# EAGLE board regsimple2addfp (EAGLE 7.5.0), part 1 of 2
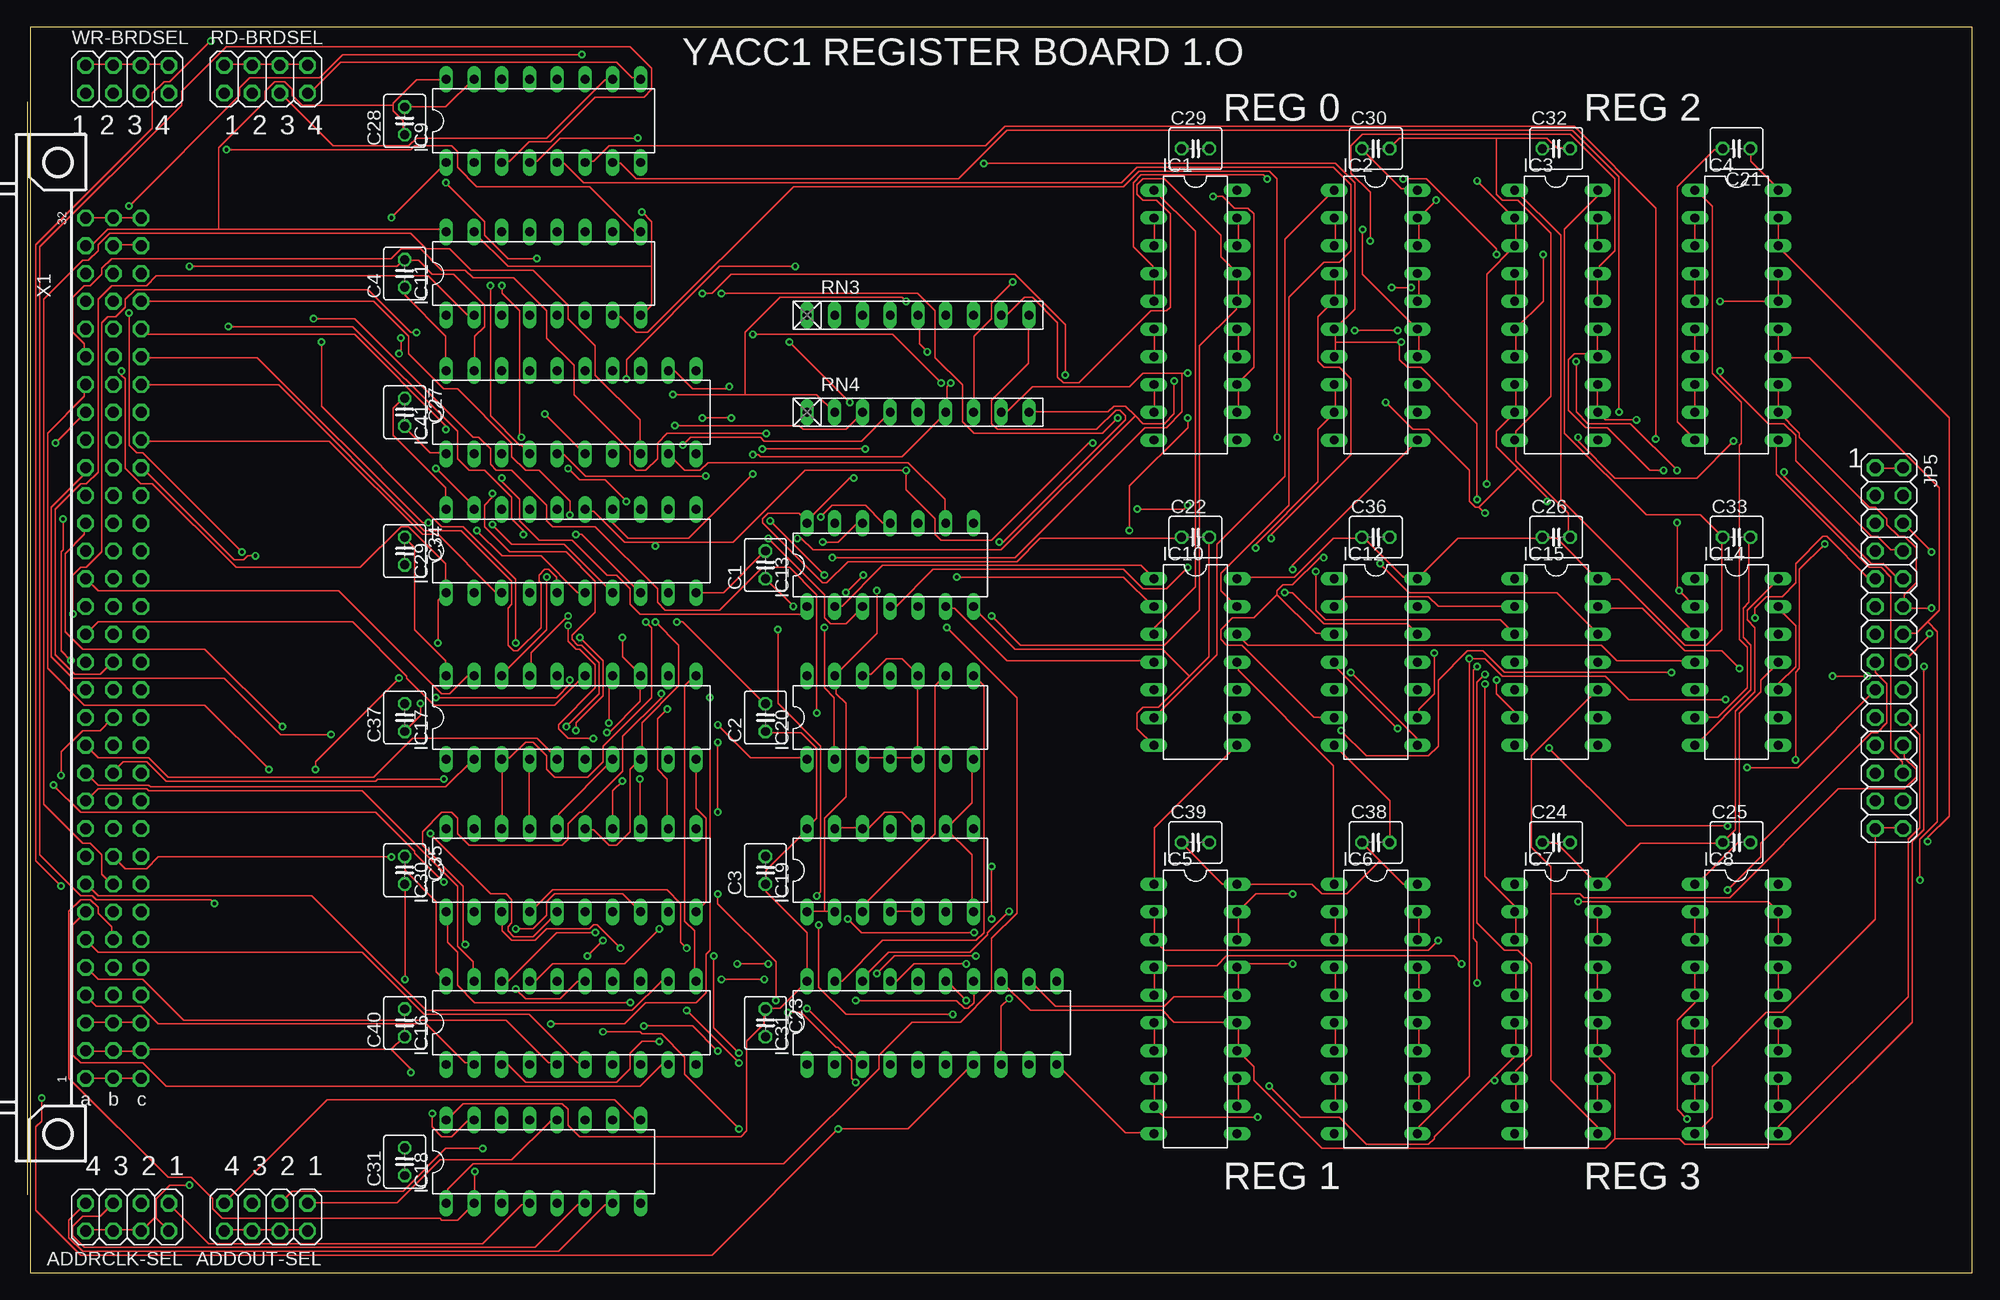
[diagram p2: board, top side]
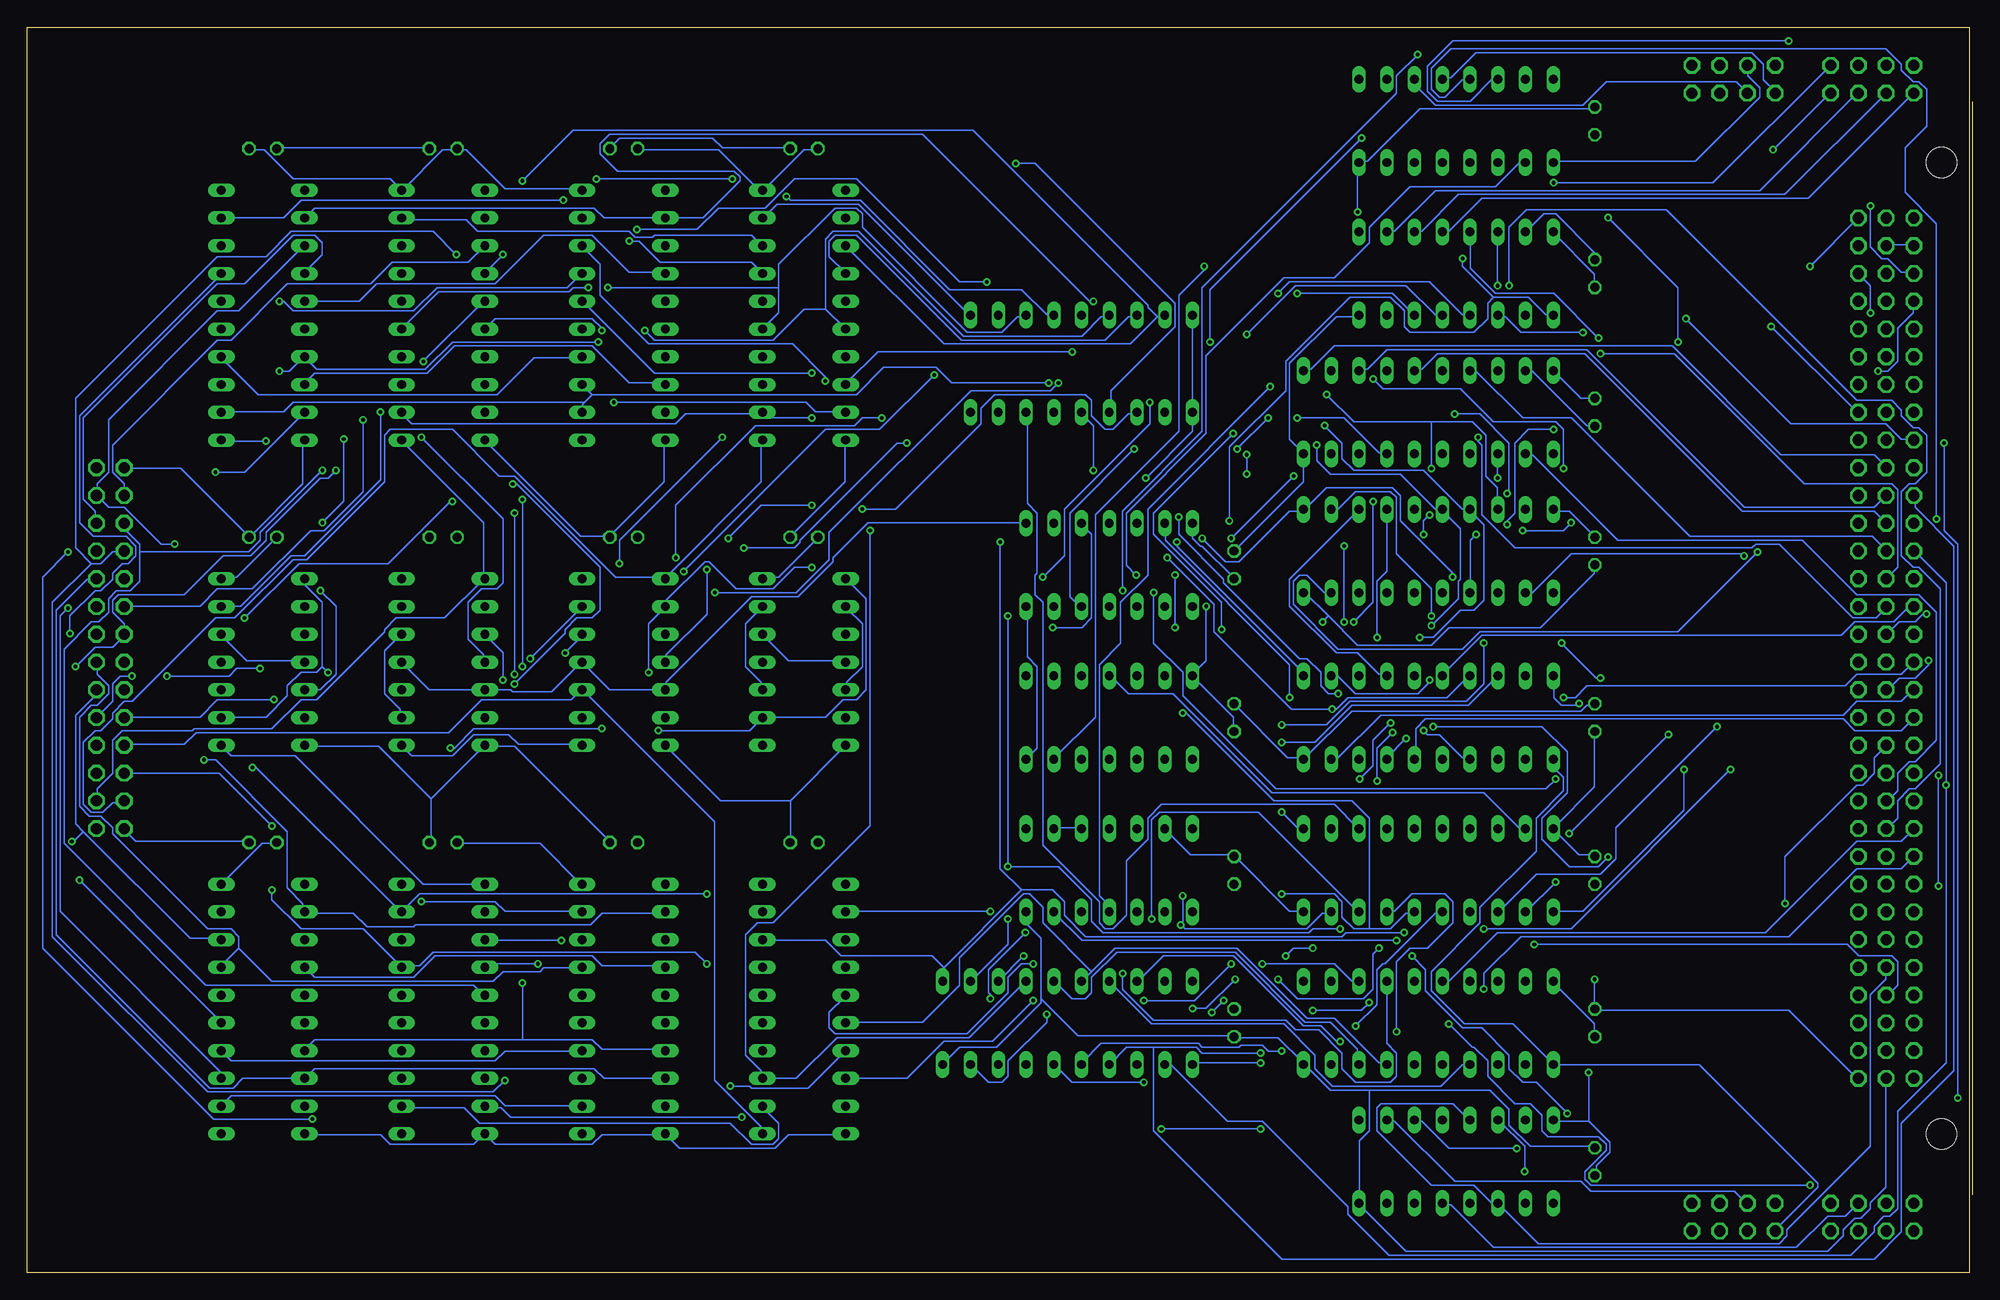
[diagram p3: board, bottom side, seen from below]

Size 177.78 x 113.97 mm. Coordinates in mm from the lower left corner, seen from the top.
Outline: 0,0 177.78,0 177.78,113.97 0,113.97 0,0
Copper layers (1*16): Top 0.0356mm / dielectric 1.5011mm / Bottom 0.0356mm
Design rules "LaenPCBOrder *": minimum track width 6mil, minimum drill 13mil, track to track 8mil, track to pad 8mil, pad to pad 8mil, via to via 8mil, smd to smd 6mil, copper to edge 15mil, drill to drill 6mil, minimum pad ring 7mil, minimum via ring 7mil, stop-mask expansion 3mil, vias tented up to drill 0mil, thermal gap 10mil

## Footprints (pad centres in the part's own frame; a part is rotated, then mirrored left to right if it is on the bottom)
2X04 = drill 1.016 octagon: 1 -3.81,-1.27; 2 -3.81,1.27; 3 -1.27,-1.27; 4 -1.27,1.27; 5 1.27,-1.27; 6 1.27,1.27; 7 3.81,-1.27; 8 3.81,1.27
C025-040X050 = drill 0.813 octagon: 1 -1.27,0; 2 1.27,0
DIL20 = drill 0.813 long: 1 -11.43,-3.81; 2 -8.89,-3.81; 3 -6.35,-3.81; 4 -3.81,-3.81; 5 -1.27,-3.81; 6 1.27,-3.81; 7 3.81,-3.81; 8 6.35,-3.81; 9 8.89,-3.81; 10 11.43,-3.81; 11 11.43,3.81; 12 8.89,3.81; 13 6.35,3.81; 14 3.81,3.81; 15 1.27,3.81; 16 -1.27,3.81; 17 -3.81,3.81; 18 -6.35,3.81; 19 -8.89,3.81; 20 -11.43,3.81
DIL16 = drill 0.813 long: 1 -8.89,-3.81; 2 -6.35,-3.81; 3 -3.81,-3.81; 4 -1.27,-3.81; 5 1.27,-3.81; 6 3.81,-3.81; 7 6.35,-3.81; 8 8.89,-3.81; 9 8.89,3.81; 10 6.35,3.81; 11 3.81,3.81; 12 1.27,3.81; 13 -1.27,3.81; 14 -3.81,3.81; 15 -6.35,3.81; 16 -8.89,3.81
DIL14 = drill 0.813 long: 1 -7.62,-3.81; 2 -5.08,-3.81; 3 -2.54,-3.81; 4 0,-3.81; 5 2.54,-3.81; 6 5.08,-3.81; 7 7.62,-3.81; 8 7.62,3.81; 9 5.08,3.81; 10 2.54,3.81; 11 0,3.81; 12 -2.54,3.81; 13 -5.08,3.81; 14 -7.62,3.81
2X14 = drill 1.016 octagon: 1 -16.51,-1.27; 2 -16.51,1.27; 3 -13.97,-1.27; 4 -13.97,1.27; 5 -11.43,-1.27; 6 -11.43,1.27; 7 -8.89,-1.27; 8 -8.89,1.27; 9 -6.35,-1.27; 10 -6.35,1.27; 11 -3.81,-1.27; 12 -3.81,1.27; 13 -1.27,-1.27; 14 -1.27,1.27; 15 1.27,-1.27; 16 1.27,1.27; 17 3.81,-1.27; 18 3.81,1.27; 19 6.35,-1.27; 20 6.35,1.27; 21 8.89,-1.27; 22 8.89,1.27; 23 11.43,-1.27; 24 11.43,1.27; 25 13.97,-1.27; 26 13.97,1.27; 27 16.51,-1.27; 28 16.51,1.27
RN-9 = drill 0.813 long: 1 -10.16,0; 2 -7.62,0; 3 -5.08,0; 4 -2.54,0; 5 0,0; 6 2.54,0; 7 5.08,0; 8 7.62,0; 9 10.16,0
FABC96R = drill 1.016 octagon: A1 -2.54,39.37; A2 -2.54,36.83; A3 -2.54,34.29; A4 -2.54,31.75; A5 -2.54,29.21; A6 -2.54,26.67; A7 -2.54,24.13; A8 -2.54,21.59; A9 -2.54,19.05; A10 -2.54,16.51; A11 -2.54,13.97; A12 -2.54,11.43; A13 -2.54,8.89; A14 -2.54,6.35; A15 -2.54,3.81; A16 -2.54,1.27; A17 -2.54,-1.27; A18 -2.54,-3.81; A19 -2.54,-6.35; A20 -2.54,-8.89; A21 -2.54,-11.43; A22 -2.54,-13.97; A23 -2.54,-16.51; A24 -2.54,-19.05; A25 -2.54,-21.59; A26 -2.54,-24.13; A27 -2.54,-26.67; A28 -2.54,-29.21; A29 -2.54,-31.75; A30 -2.54,-34.29; A31 -2.54,-36.83; A32 -2.54,-39.37; B1 -5.08,39.37; B2 -5.08,36.83; B3 -5.08,34.29; B4 -5.08,31.75; B5 -5.08,29.21; B6 -5.08,26.67; B7 -5.08,24.13; B8 -5.08,21.59; B9 -5.08,19.05; B10 -5.08,16.51; B11 -5.08,13.97; B12 -5.08,11.43; B13 -5.08,8.89; B14 -5.08,6.35; B15 -5.08,3.81; B16 -5.08,1.27; B17 -5.08,-1.27; B18 -5.08,-3.81; B19 -5.08,-6.35; B20 -5.08,-8.89; B21 -5.08,-11.43; B22 -5.08,-13.97; B23 -5.08,-16.51; B24 -5.08,-19.05; B25 -5.08,-21.59; B26 -5.08,-24.13; B27 -5.08,-26.67; B28 -5.08,-29.21; B29 -5.08,-31.75; B30 -5.08,-34.29; B31 -5.08,-36.83; B32 -5.08,-39.37; C1 -7.62,39.37; C2 -7.62,36.83; C3 -7.62,34.29; C4 -7.62,31.75; C5 -7.62,29.21; C6 -7.62,26.67; C7 -7.62,24.13; C8 -7.62,21.59; C9 -7.62,19.05; C10 -7.62,16.51; C11 -7.62,13.97; C12 -7.62,11.43; C13 -7.62,8.89; C14 -7.62,6.35; C15 -7.62,3.81; C16 -7.62,1.27; C17 -7.62,-1.27; C18 -7.62,-3.81; C19 -7.62,-6.35; C20 -7.62,-8.89; C21 -7.62,-11.43; C22 -7.62,-13.97; C23 -7.62,-16.51; C24 -7.62,-19.05; C25 -7.62,-21.59; C26 -7.62,-24.13; C27 -7.62,-26.67; C28 -7.62,-29.21; C29 -7.62,-31.75; C30 -7.62,-34.29; C31 -7.62,-36.83; C32 -7.62,-39.37 | hole 2.794: 0,-44.456; 0,44.456

## Placement (x,y rotation side)
ADDOUT-SEL  [2X04]  21.59,5.08 180 top
ADDRCLK-SEL  [2X04]  8.89,5.08 180 top
C1  [C025-040X050]  67.31,64.77 90 top
C2  [C025-040X050]  67.31,50.8 90 top
C3  [C025-040X050]  67.31,36.83 90 top
C4  [C025-040X050]  34.29,91.44 90 top
C21  [C025-040X050]  156.21,102.87 180 top
C22  [C025-040X050]  106.68,67.31 0 top
C23  [C025-040X050]  67.31,22.86 270 top
C24  [C025-040X050]  139.7,39.37 0 top
C25  [C025-040X050]  156.21,39.37 0 top
C26  [C025-040X050]  139.7,67.31 0 top
C27  [C025-040X050]  34.29,78.74 270 top
C28  [C025-040X050]  34.29,105.41 90 top
C29  [C025-040X050]  106.68,102.87 0 top
C30  [C025-040X050]  123.19,102.87 0 top
C31  [C025-040X050]  34.29,10.16 90 top
C32  [C025-040X050]  139.7,102.87 0 top
C33  [C025-040X050]  156.21,67.31 0 top
C34  [C025-040X050]  34.29,66.04 270 top
C35  [C025-040X050]  34.29,36.83 270 top
C36  [C025-040X050]  123.19,67.31 0 top
C37  [C025-040X050]  34.29,50.8 90 top
C38  [C025-040X050]  123.19,39.37 0 top
C39  [C025-040X050]  106.68,39.37 0 top
C40  [C025-040X050]  34.29,22.86 90 top
IC1  74S374N  [DIL20]  106.68,87.63 270 top
IC2  74S374N  [DIL20]  123.19,87.63 270 top
IC3  74S374N  [DIL20]  139.7,87.63 270 top
IC4  74S374N  [DIL20]  156.21,87.63 270 top
IC5  74S374N  [DIL20]  106.68,24.13 270 top
IC6  74S374N  [DIL20]  123.19,24.13 270 top
IC7  74S374N  [DIL20]  139.7,24.13 270 top
IC8  74S374N  [DIL20]  156.21,24.13 270 top
IC9  74LS139N  [DIL16]  46.99,105.41 0 top
IC10  7432N  [DIL14]  106.68,55.88 270 top
IC11  74LS139N  [DIL16]  46.99,91.44 0 top
IC12  74LS02N  [DIL14]  123.19,55.88 270 top
IC13  74LS04N  [DIL14]  78.74,64.77 0 top
IC14  7432N  [DIL14]  156.21,55.88 270 top
IC15  74LS02N  [DIL14]  139.7,55.88 270 top
IC16  74S374N  [DIL20]  49.53,22.86 0 top
IC17  74S374N  [DIL20]  49.53,50.8 0 top
IC18  74LS139N  [DIL16]  46.99,10.16 0 top
IC19  74LS00N  [DIL14]  78.74,36.83 0 top
IC20  74LS00N  [DIL14]  78.74,50.8 0 top
IC29  74LS245N  [DIL20]  49.53,66.04 0 top
IC30  74LS245N  [DIL20]  49.53,36.83 0 top
IC31  74LS245N  [DIL20]  82.55,22.86 0 top
IC41  74S244N  [DIL20]  49.53,78.74 0 top
JP5  [2X14]  170.18,57.15 270 top
RD-BRDSEL  [2X04]  21.59,109.22 0 top
RN3  [RN-9]  81.28,87.63 0 top
RN4  [RN-9]  81.28,78.74 0 top
WR-BRDSEL  [2X04]  8.89,109.22 0 top
X1  FABC96R  [FABC96R]  2.54,57.15 180 top

## Tracks (layer width: path | path; a pad name or v marks a point on that pad's centre or on a via)
+12V
  Top 0.152: X1.A3 5.16,22.94 7.47,22.94 X1.B3 7.64,22.94 10.13,22.94 X1.C3
-R0-RDSEL  (via drill 0.33)
  Top 0.152: v55.65,103.83 48.54,103.83 46.41,101.7 45.87,101.7 IC9.4 | v75.03,79.65 v69.52,85.17 | v84.81,63.65 100.1,63.65 102.77,60.98 IC10.2
  Bottom 0.152: v55.65,103.83 69.52,89.97 v69.52,85.17 | v75.03,79.65 75.03,77.7 82.86,69.88 82.86,65.61 v84.81,63.65 | IC10.5 102.77,53.34 102.77,54.05 101.35,55.47 101.35,59.38 102.77,60.81 IC10.2
-R0-WRSEL  (via drill 0.33)
  Top 0.152: v63.3,89.61 81.25,89.61 82.86,88.01 82.86,83.74 85.34,81.25 85.34,77.88 86.41,76.81 98.15,76.81 v99.57,78.23 | v118.42,65.43 118.06,65.43 115.57,62.94 114.68,62.94 114.15,62.41 114.15,62.05 | 114.15,62.05 117.7,58.5 119.3,58.5 IC12.3 | 114.15,62.05 112.01,59.92 110.06,59.92 108.99,58.85 108.99,57.96 109.53,57.43 110.95,57.43 117.53,50.85 119.3,50.85 IC12.6
  Bottom 0.152: v63.3,89.61 62.23,90.68 49.43,90.68 46.41,87.66 45.87,87.66 IC11.4 | v99.57,78.23 101.35,78.23 102.06,77.52 111.12,77.52 118.42,70.23 v118.42,65.43
-R1-RDSEL
  Top 0.152: IC9.5 48.36,101.52 48.9,101.52 50.67,99.75 99.92,99.75 101.35,101.17 119.3,101.17 120.9,99.57 120.9,93.52 119.84,92.46 118.42,92.46 115.21,89.26 115.21,70.23 108.99,64.01 108.99,62.41 110.41,60.98 IC10.13
  Bottom 0.152: IC10.10 110.59,53.34 110.59,54.05 112.01,55.47 112.01,59.38 110.59,60.81 IC10.13
-R1-WRSEL  (via drill 0.33)
  Top 0.152: v128.55,56.72 128.55,52.98 127.13,51.56 127.13,50.85 IC12.9 | v66.14,85.88 78.94,85.88 v83.39,81.43 | v114.86,62.23 115.57,62.23 118.42,59.38 126.06,59.38 126.95,58.5 IC12.12
  Bottom 0.152: v128.55,56.72 126.95,58.32 IC12.12 | v66.14,85.88 61.7,90.32 51.56,90.32 48.9,87.66 48.36,87.66 IC11.5 | v83.39,81.43 84.1,80.72 91.39,80.72 104.37,67.74 104.37,65.25 107.39,62.23 v114.86,62.23
-R2-RDSEL  (via drill 0.33)
  Top 0.152: v148.82,76.28 148.82,97.43 141.35,104.9 89.26,104.9 87.48,103.12 52.98,103.12 51.56,101.7 50.85,101.7 IC9.6 | v150.77,68.63 150.77,62.59 v150.95,62.41 IC14.2
  Bottom 0.152: v148.82,76.28 148.82,70.59 v150.77,68.63 | IC14.5 150.95,53.34 149.53,54.76 149.53,60.98 v150.95,62.41
-R2-WRSEL  (via drill 0.33)
  Top 0.152: v61.52,89.61 62.41,89.61 64.19,91.39 90.14,91.39 94.77,86.77 v94.77,82.14 | v117.7,64.19 117.7,60.63 118.59,59.74 134.59,59.74 135.84,58.5 IC15.3 | v134.24,54.23 134.24,52.98 135.84,51.38 135.84,50.85 IC15.6
  Bottom 0.152: v61.52,89.61 52.81,89.61 50.85,87.66 IC11.6 | v94.77,82.14 99.75,77.17 104.72,77.17 v117.7,64.19 | v134.24,54.23 134.24,56.72 135.84,58.32 IC15.3
-R3-RDSEL  (via drill 0.33)
  Top 0.152: v145.44,78.77 145.44,100.28 141.17,104.55 89.43,104.55 84.99,100.1 55.47,100.1 54.05,101.52 53.34,101.52 IC9.7 | IC14.10 160.02,53.87 161.62,55.47 161.62,59.21 160.02,60.81 IC14.13
  Bottom 0.152: v145.44,78.77 145.44,72.54 152.38,65.61 153.62,65.61 158.24,60.98 160.02,60.98 IC14.13
-R3-WRSEL  (via drill 0.33)
  Top 0.152: v114.15,76.45 114.15,100.1 113.44,100.81 101.52,100.81 100.1,99.39 69.88,99.39 56.54,86.06 55.47,86.06 54.05,87.48 53.34,87.48 IC11.7 | v123.57,64.9 126.24,62.23 139.75,62.23 143.49,58.5 IC15.12
  Bottom 0.152: v114.15,76.45 123.57,67.03 v123.57,64.9 | IC15.9 143.66,50.85 143.66,51.56 145.09,52.98 145.09,56.9 143.66,58.32 IC15.12
-RDSEL  (via drill 0.33)
  Top 0.152: RD-BRDSEL.2 17.78,110.59 20.27,110.59 RD-BRDSEL.4 20.45,110.59 22.76,110.59 RD-BRDSEL.6 22.94,110.59 25.25,110.59 RD-BRDSEL.8 | v62.94,50.14 65.96,47.12 71.12,47.12 IC20.1 | v44.45,57.61 44.45,63.48 39.65,68.28 37.69,68.28 26.67,79.3 v26.67,85.17 | v33.07,96.55 38.05,101.52 IC9.1
  Bottom 0.152: v62.94,50.14 58.85,50.14 56.72,52.27 46.05,52.27 44.45,53.87 v44.45,57.61 | v26.67,85.17 26.67,90.14 v33.07,96.55 | RD-BRDSEL.4 20.27,110.41 20.27,109.53 19.2,108.46 19.2,107.57 25.07,101.7 38.05,101.7 IC9.1
-RRDH
  Top 0.152: IC13.6 83.92,60.81 84.63,60.81 89.43,56.01 102.77,56.01 IC10.4 | IC10.12 111.48,57.43 143.84,57.43 145.26,56.01 152.38,56.01 IC14.4
  Bottom 0.152: IC14.4 152.55,56.01 157.71,56.01 160.02,58.32 IC14.12 | IC10.4 102.95,56.01 108.1,56.01 110.41,58.32 IC10.12
-RRDL  (via drill 0.33)
  Top 0.152: IC13.2 73.79,60.98 74.32,60.98 78.05,64.72 101.7,64.72 102.77,63.65 IC10.1 | v150.24,54.94 134.95,54.94 132.99,56.9 131.57,56.9 128.91,54.23 128.91,48.18 128.02,47.3 122.33,47.3 v120.02,49.61
  Bottom 0.152: 150.77,55.47 151.31,54.94 152.73,54.94 153.97,53.7 153.97,52.81 155.93,50.85 160.02,50.85 IC14.9 | 150.77,55.47 150.77,61.34 152.38,62.94 152.38,63.48 IC14.1 | IC10.1 102.77,63.48 100.99,61.7 100.99,53.34 101.88,52.45 103.12,52.45 104.72,50.85 110.41,50.85 IC10.9 110.59,50.67 111.66,49.61 v120.02,49.61 | v150.24,54.94 150.77,55.47
-RWRH
  Bottom 0.152: IC15.11 143.49,55.83 141,53.34 IC15.5 133.53,53.34 133.35,53.16 129.79,53.16 127.13,55.83 IC12.11 124.46,53.34 IC12.5 119.3,53.34 119.3,54.05 111.48,61.87 107.21,61.87 104.01,65.08 104.01,65.43 100.81,68.63 86.41,68.63 IC13.8
-RWRL  (via drill 0.33)
  Top 0.152: v105.97,64.54 104.01,62.59 101.88,62.59 100.1,64.36 82.68,64.36 79.3,60.98 78.77,60.98 IC13.4 | IC15.2 135.84,60.98 128.91,60.98 128.02,61.87 120.37,61.87 119.48,60.98 IC12.2 | v120.9,54.94 126.95,48.9 126.95,48.36 IC12.8
  Bottom 0.152: IC12.8 127.13,48.36 132.82,48.36 133.71,49.25 136.91,49.25 138.86,47.3 142.6,47.3 143.49,48.18 IC15.8 | v105.97,64.54 107.57,64.54 109.53,62.59 112.9,62.59 115.39,65.08 115.75,65.08 119.3,61.52 119.3,60.98 IC12.2 119.48,60.81 120.9,59.38 v120.9,54.94
-WRSEL  (via drill 0.33)
  Top 0.152: WR-BRDSEL.2 5.16,110.59 7.47,110.59 WR-BRDSEL.4 7.64,110.59 10.13,110.59 WR-BRDSEL.6 10.31,110.59 12.62,110.59 WR-BRDSEL.8 | v46.41,92.81 43.74,92.81 41.6,94.94 41.6,96.19 v38.05,99.75 | v72.72,59.03 72.72,53.52 73.61,52.63 73.61,47.12 IC20.2 | v67.74,68.81 v72.72,63.83
  Bottom 0.152: 43.56,89.26 40.36,89.26 38.76,87.66 38.23,87.66 IC11.1 | 43.56,89.26 46.41,92.1 v46.41,92.81 | v38.05,99.75 23.47,99.75 12.8,110.41 WR-BRDSEL.8 | v72.72,63.83 v72.72,59.03 | v67.74,68.81 67.74,75.56 62.59,80.72 62.59,83.39 56.72,89.26 52.98,89.26 51.74,88.01 51.74,86.59 51.21,86.06 45.34,86.06 44.09,87.3 44.09,88.72 43.56,89.26
ADDR0
  Top 0.152: IC16.2 40.54,19.2 39.83,19.2 36.27,22.76 11.73,22.76 10.13,24.36 6.04,24.36 5.16,25.25 X1.A4
ADDR1
  Top 0.152: IC16.5 48.18,19.2 47.47,19.2 43.56,23.11 14.05,23.11 10.31,26.85 6.22,26.85 5.16,27.91 X1.A5
ADDR2
  Top 0.152: X1.A6 6.22,29.34 30.4,29.34 36.09,23.65 45.7,23.65 50.14,19.2 50.67,19.2 IC16.6
ADDR3
  Top 0.152: IC16.9 58.32,19.02 57.78,19.02 55.83,17.07 12.45,17.07 10.31,19.2 4.62,19.2 3.91,19.91 3.91,31.83 4.98,32.89 X1.A7
ADDR4
  Top 0.152: IC16.12 57.78,26.67 55.12,24 36.27,24 25.78,34.49 6.22,34.49 5.16,35.56 X1.A8
ADDR5  (via drill 0.33)
  Top 0.152: IC16.15 50.14,26.67 48.54,25.07 45.34,25.07 v44.45,25.96
  Bottom 0.152: v44.45,25.96 44.45,27.38 41.07,30.76 16.54,30.76 10.31,36.98 6.22,36.98 5.16,38.05 X1.A9
ADDR6
  Bottom 0.152: IC16.16 47.65,26.67 43.2,31.11 18.67,31.11 10.31,39.47 6.22,39.47 5.16,40.54 X1.A10
ADDR7
  Top 0.152: IC16.19 40.54,26.67 40.54,28.45 39.12,29.87 39.12,35.38 30.4,44.09 10.85,44.09 10.67,44.27 6.22,44.27 5.16,43.2 X1.A11
ADDR8
  Top 0.152: IC17.2 40.54,46.94 38.05,44.45 11.02,44.45 10.85,44.63 6.22,44.63 5.16,45.7 X1.A12
ADDR9
  Top 0.152: X1.A13 6.22,47.12 10.85,47.12 12.62,45.34 31.47,45.34 35.03,48.9 46.41,48.9 48.18,47.12 IC17.5
ADDR10
  Bottom 0.152: IC17.6 50.67,47.12 50.67,49.78 49.78,50.67 11.56,50.67 10.49,49.61 6.22,49.61 5.16,50.67 X1.A14
ADDR11
  Bottom 0.152: IC17.9 58.32,47.12 57.78,47.12 53.87,51.03 11.56,51.03 10.31,52.27 6.22,52.27 5.16,53.34 X1.A15
ADDR12  (via drill 0.33)
  Top 0.152: v49.43,54.23 49.43,53.87 48.18,52.63 v37.16,52.63
  Bottom 0.152: v49.43,54.23 49.43,54.05 50.49,52.98 56.19,52.98 57.78,54.59 58.32,54.59 IC17.12 | v37.16,52.63 36.09,52.63 35.03,53.7 11.38,53.7 10.31,54.76 6.22,54.76 5.16,55.83 X1.A16
ADDR13
  Top 0.152: X1.A17 6.22,59.56 29.52,59.56 34.49,54.59 34.49,54.41 36.98,51.92 48.01,51.92 50.67,54.59 IC17.15
ADDR14
  Bottom 0.152: IC17.16 48.18,54.76 44.63,58.32 11.73,58.32 10.49,59.56 6.93,59.56 5.69,60.81 5.16,60.81 X1.A18
ADDR15
  Top 0.152: IC17.19 40.54,54.59 40.01,54.59 38.41,52.98 37.69,52.98 28.27,62.41 6.22,62.41 5.16,63.48 X1.A19
BDATA0  (via drill 0.33)
  Top 0.152: v37.87,35.74 35.2,38.41 35.2,38.58 31.65,42.14 4.62,42.14 v2.13,44.63
  Bottom 0.152: v37.87,35.74 40.54,33.07 IC30.2 | X1.A20 4.98,65.96 2.13,63.12 v2.13,44.63 2.13,19.2 6.58,14.76 6.58,5.87 7.29,5.16 7.82,5.16 8.71,4.27 8.71,3.73 10.85,1.6 53.16,1.6 56.9,5.33 56.9,6.04 64.72,13.87 67.92,13.87 73.08,19.02 73.61,19.02 IC31.2
BDATA1  (via drill 0.33)
  Top 0.152: v71.12,24.18 76.1,19.2 IC31.3 | v63.3,26.85 v67.21,26.85 | v54.05,29.69 51.92,31.83 51.56,31.83 51.21,31.47 47.3,31.47 46.23,30.4 44.09,30.4 43.2,31.29 43.2,32.89 IC30.3 | v23.11,49.96 16,57.07 4.8,57.07 3.2,58.67 3.2,65.79 4.98,67.56 4.98,68.45 X1.A21
  Bottom 0.152: v71.12,24.18 69.88,24.18 v67.21,26.85 | v63.3,26.85 61.52,25.07 55.47,25.07 54.59,25.96 54.59,29.16 v54.05,29.69 | v23.11,49.96 32.36,40.72 32.36,37.87 33.78,36.45 39.65,36.45 43.03,33.07 IC30.3
BDATA2  (via drill 0.33)
  Top 0.152: v60.1,29.69 59.56,30.23 59.56,33.78 58.32,35.03 47.83,35.03 45.87,33.07 IC30.4 | v62.59,28.98 62.59,22.4 v64.9,20.09
  Bottom 0.152: v60.1,29.69 61.87,29.69 v62.59,28.98 | v64.9,20.09 70.23,20.09 70.76,20.62 74.68,20.62 | 74.68,20.62 77.17,20.62 IC31.4 | 74.68,20.62 74.68,12.98 62.94,1.25 8.71,1.25 6.22,3.73 6.22,13.69 1.42,18.49 1.42,66.5 4.98,70.05 4.98,71.12 X1.A22
BDATA3  (via drill 0.33)
  Top 0.152: v56.19,22.58 60.63,22.58 v62.94,20.27 | v27.56,49.25 22.94,49.25 17.78,54.41 3.91,54.41 1.96,56.36 1.96,70.05 4.98,73.08 4.98,73.61 X1.A23 | v36.63,40.18 42.14,34.67 43.56,34.67 44.09,34.14 44.09,32 43.74,31.65 43.74,31.29 44.27,30.76 46.05,30.76 48.18,32.89 IC30.5
  Bottom 0.152: v56.19,22.58 54.23,24.54 54.23,27.74 53.7,28.27 53.52,28.27 48.9,32.89 48.36,32.89 IC30.5 | v62.94,20.27 64.19,20.27 64.72,20.8 66.67,20.8 66.85,20.62 70.23,20.62 70.59,20.98 79.48,20.98 81.25,19.2 IC31.5 | v36.63,40.18 v27.56,49.25
BDATA4  (via drill 0.33)
  Top 0.152: v62.94,34.67 62.94,33.78 68.28,28.45 v68.28,24.89 | v69.34,23.82 70.59,23.82 73.79,20.62 73.97,20.62 75.21,19.38 75.21,17.78 v75.56,17.42 | v25.96,87.3 29.69,87.3 40.54,76.45 41.07,76.45 42.14,75.39 42.14,73.97 42.67,73.43 44.09,73.43 47.3,70.23 47.3,68.81 47.83,68.28 51.74,68.28 57.43,62.59 57.43,61.34 58.14,60.63 63.12,60.63 67.03,64.54 69.52,64.54 72.01,62.05 v72.01,51.21
  Bottom 0.152: 54.94,31.47 56.36,31.47 57.43,32.54 57.43,33.96 58.14,34.67 v62.94,34.67 | 54.94,31.47 52.98,31.47 51.56,32.89 50.85,32.89 IC30.6 | v69.34,23.82 v68.28,24.89 | v75.56,17.42 82.14,17.42 83.74,19.02 IC31.6 | v25.96,87.3 16.36,77.7 7.64,77.7 6.22,76.28 5.16,76.28 X1.A24 | v72.01,51.21 71.65,51.21 63.65,43.2 56.54,43.2 54.94,41.6 54.94,31.47
BDATA5  (via drill 0.33)
  Top 0.152: v52.45,22.05 55.83,22.05 56.01,21.87 57.78,21.87 59.92,19.74 59.92,18.14 v64.9,13.16 | IC31.7 86.23,19.02 80.37,13.16 v73.97,13.16 62.41,1.6 4.62,1.6 0.53,5.69 0.53,13.34 1.07,13.87 v1.07,16 | v2.31,75.92 4.98,78.59 X1.A25
  Bottom 0.152: v52.45,22.05 52.45,28.45 51.21,29.69 49.61,29.69 47.3,32 47.3,33.96 48.01,34.67 51.03,34.67 52.63,33.07 53.34,33.07 IC30.7 | v73.97,13.16 v64.9,13.16 | v2.31,75.92 2.31,67.92 1.07,66.67 v1.07,16
BDATA6  (via drill 0.33)
  Top 0.152: IC31.8 88.9,24.36 v89.61,25.07 | v86.41,31.11 76.1,31.11 v74.85,32.36 | v21.87,46.05 16,51.92 4.98,51.92 1.6,55.3 1.6,76.81 4.98,80.19 4.98,81.25 X1.A26 | v44.45,31.47 46.05,31.47 47.3,32.72 47.3,33.96 48.01,34.67 54.23,34.67 IC30.8
  Bottom 0.152: v89.61,25.07 89.61,25.43 89.79,25.6 89.79,27.74 v86.41,31.11 | v74.85,32.36 74.85,41.43 74.14,42.14 65.08,42.14 56.01,33.07 IC30.8 | v21.87,46.05 36.45,31.47 v44.45,31.47
BDATA7  (via drill 0.33)
  Top 0.152: v72.19,31.83 72.19,26.14 74.68,23.65 v84.45,23.65 | v67.39,76.81 58.32,76.81 57.43,75.92 57.43,74.5 56.36,73.43 55.47,73.43 54.94,73.97 54.94,75.21 49.78,80.37 49.78,83.03 47.3,85.52 47.3,88.01 44.27,91.03 40.54,91.03 39.83,91.75 37.69,91.75 35.74,93.7 33.96,93.7 33.07,92.81 7.47,92.81 6.58,91.92 6.58,91.39 5.51,90.32 4.98,90.32 3.91,89.26 3.91,86.06 4.98,84.99 4.98,83.92 X1.A27 | v68.45,58.85 68.45,52.09 72.36,48.18 72.36,34.85 v72.01,34.49
  Bottom 0.152: 72.01,31.65 71.83,31.47 60.63,31.47 59.21,32.89 58.5,32.89 IC30.9 | v84.45,23.65 84.45,22.94 88.01,19.38 88.01,17.96 88.54,17.42 89.79,17.42 91.39,19.02 IC31.9 | v67.39,76.81 74.68,69.52 74.68,67.56 68.45,61.34 v68.45,58.85 | 72.01,31.65 v72.01,34.49 | 72.01,31.65 v72.19,31.83
BDATA8  (via drill 0.33)
  Top 0.152: v20.62,65.61 19.91,65.61 19.56,65.25 18.67,65.25 10.31,73.61 X1.C23
  Bottom 0.152: IC29.2 40.01,62.23 36.45,65.79 20.8,65.79 v20.62,65.61
BDATA9
  Top 0.152: IC29.3 42.67,62.23 37.34,67.56 35.92,67.56 27.38,76.1 10.31,76.1 X1.C24
BDATA10  (via drill 0.33)
  Top 0.152: v45.16,67.56 45.16,67.92 44.09,68.99 44.09,70.94 41.6,73.43 40.18,73.43 39.12,74.5 39.12,76.99 29.52,86.59 v18.14,86.59
  Bottom 0.152: v45.16,67.56 45.7,67.03 45.7,62.23 IC29.4 | v18.14,86.59 10.31,78.77 X1.C25
BDATA11
  Top 0.152: IC29.5 48.18,62.23 48.18,63.65 47.47,64.36 47.12,64.36 46.58,63.83 46.58,63.3 46.76,63.12 46.76,59.03 44.63,56.9 44.27,56.9 43.74,57.43 43.74,60.81 44.09,61.16 44.09,63.3 39.47,67.92 36.09,67.92 22.76,81.25 10.31,81.25 X1.C26
BDATA12  (via drill 0.33)
  Top 0.152: IC29.6 50.14,62.23 46.76,65.61 43.2,65.61 v40.89,67.92 | v36.45,68.63 35.92,68.63 20.8,83.74 10.31,83.74 X1.C27
  Bottom 0.152: v40.89,67.92 37.16,67.92 v36.45,68.63
BDATA13  (via drill 0.33)
  Top 0.152: IC29.7 48.9,66.67 44.09,66.67 v42.32,68.45 | v38.05,77.17 38.05,77.52 29.69,85.88 10.67,85.88 10.31,86.23 X1.C28
  Bottom 0.152: v42.32,68.45 42.32,68.81 41.6,69.52 41.6,75.92 40.36,77.17 v38.05,77.17
BDATA14  (via drill 0.33)
  Top 0.152: v49.96,67.56 50.49,67.56 55.83,62.23 IC29.8 | v49.43,69.34 49.43,70.59 46.58,73.43 45.34,73.43 44.09,74.68 44.09,75.92 39.12,80.9 37.87,80.9 34.67,84.1 34.67,85.7 31.47,88.9 X1.C29
  Bottom 0.152: v49.96,67.56 49.96,68.81 v49.43,69.34
BDATA15  (via drill 0.33)
  Top 0.152: v19.38,65.96 10.31,75.03 9.78,75.03 9.07,75.74 v9.07,87.83
  Bottom 0.152: IC29.9 59.03,62.23 60.63,63.83 61.34,63.83 61.87,63.3 61.87,61.16 57.78,57.07 46.41,57.07 44.81,58.67 26.67,58.67 v19.38,65.96 | v9.07,87.83 9.07,90.32 10.13,91.39 X1.C30
BDIR  (via drill 0.33)
  Top 0.152: v26.14,46.05 26.14,46.76 v33.78,54.41 | v37.34,57.61 37.34,61.52 38.05,62.23 | v60.1,24 v64.9,19.2 | v54.94,24.71 40.72,24.71 39.12,26.31 39.12,29.34 38.23,30.23 38.23,32.89 IC30.1 | v8.36,82.5 8.36,82.14 8.71,81.79 8.71,73.61 10.13,72.19 11.2,72.19 18.85,64.54 30.23,64.54 33.96,68.28 34.67,68.28 38.05,64.9 38.05,62.23 | 38.05,62.23 IC29.1
  Bottom 0.152: v26.14,46.05 26.14,42.32 35.38,33.07 38.05,33.07 IC30.1 | v33.78,54.41 34.14,54.41 v37.34,57.61 | v64.9,19.2 71.12,19.2 IC31.1 | v60.1,24 55.65,24 v54.94,24.71 | v8.36,82.5 7.47,82.5 6.58,83.39 6.58,86.41 5.16,87.83 5.16,88.9 X1.A29
BRAOUT
  Top 0.152: IC41.8 55.83,75.03 55.83,78.05 51.74,82.14 51.74,84.81 49.25,87.3 49.25,88.54 46.05,91.75 40.36,91.75 38.41,93.7 36.27,93.7 34.85,95.12 7.29,95.12 6.22,94.06 6.22,93.52 5.33,92.63 4.8,92.63 1.25,89.08 1.25,42.85 4.8,39.29 5.51,39.29 6.58,38.23 6.58,36.45 7.47,35.56 X1.B8
BRDN  (via drill 0.33)
  Top 0.152: v47.12,78.59 50.67,75.03 IC41.6 | v42.32,71.3 42.32,70.94 41.6,70.23 41.6,68.28 43.92,65.96 49.07,65.96 51.74,63.3 51.74,60.45 49.61,58.32 49.61,57.96 50.14,57.43 50.49,57.43 52.09,55.83 52.09,52.98 v49.07,49.96 | v33.07,38.05 11.73,38.05 10.67,36.98 8.71,36.98 7.64,38.05 X1.B9
  Bottom 0.152: v47.12,78.59 44.81,78.59 42.14,75.92 42.14,71.48 v42.32,71.3 | v49.07,49.96 39.12,49.96 36.8,47.65 36.8,43.92 39.12,41.6 39.12,39.65 36.63,37.16 33.96,37.16 v33.07,38.05
BRESET
  Bottom 0.152: IC41.2 40.54,74.85 40.01,74.85 32.18,67.03 15.29,67.03 10.31,62.05 4.62,62.05 3.02,60.45 3.02,48.72 4.98,46.76 5.51,46.76 6.58,45.7 6.58,44.09 7.47,43.2 X1.B11
BRRDH
  Bottom 0.152: IC41.13 55.83,82.68 55.12,82.68 53.34,84.45 35.03,84.45 20.62,70.05 8.71,70.05 7.64,71.12 X1.B22
BRRDL
  Bottom 0.152: IC41.17 45.7,82.5 45.16,82.5 40.89,78.23 36.45,78.23 25.6,67.39 8.89,67.39 7.64,66.14 X1.B20
BRUP  (via drill 0.33)
  Top 0.152: v42.14,90.32 42.14,78.41 44.81,75.74 44.98,75.74 45.7,75.03 IC41.4
  Bottom 0.152: v42.14,90.32 42.14,95.66 40.54,97.26 27.74,97.26 10.31,79.83 7.11,79.83 6.22,78.94 6.22,78.41 5.16,77.34 4.62,77.34 3.91,76.63 3.91,73.25 4.98,72.19 5.51,72.19 6.22,71.48 6.22,65.61 5.16,64.54 4.62,64.54 2.67,62.59 2.67,46.58 4.98,44.27 5.51,44.27 6.58,43.2 6.58,41.6 7.47,40.72 X1.B10
BRWRH
  Bottom 0.152: IC41.11 60.81,82.68 60.27,82.68 58.14,84.81 27.2,84.81 17.25,74.85 8.71,74.85 7.64,73.79 X1.B23
BRWRL
  Bottom 0.152: IC41.15 50.67,82.68 50.14,82.68 48.72,84.1 35.2,84.1 20.8,69.7 8.71,69.7 7.64,68.63 X1.B21
CLK0H  (via drill 0.33)
  Top 0.152: v115.57,64.36 115.57,64.72 126.95,76.1 IC2.11 | v155.4,40.89 146.15,40.89 v139.04,48.01 | v125.17,49.78 119.48,55.47 119.48,55.83 IC12.4
  Bottom 0.152: v115.57,64.36 115.57,60.27 119.3,56.54 119.3,56.01 IC12.4 | v155.4,40.89 160.2,45.7 168.91,45.7 JP5.23 | v139.04,48.01 138.68,48.01 136.91,49.78 v125.17,49.78
CLK0L
  Bottom 0.152: IC1.11 110.59,76.1 110.59,72.36 119.3,63.65 IC12.1 119.48,63.65 123.93,63.65 133.17,72.9 134.59,72.9 138.86,77.17 144.55,77.17 145.09,76.63 145.09,72.36 152.2,65.25 153.44,65.25 158.78,59.92 160.55,59.92 168.2,52.27 168.91,52.27 169.98,51.21 169.98,50.67 171.04,49.61 171.58,49.61 172.64,48.54 172.64,42.85 171.93,42.14 170.87,42.14 169.98,43.03 168.91,43.03 JP5.25
CLK1H  (via drill 0.33)
  Top 0.152: IC6.11 127.13,12.8 127.13,13.34 131.75,17.96 v131.75,56.19 133.17,56.19 134.77,54.59 144.2,54.59 146.33,52.45 v155.22,52.45
  Bottom 0.152: v131.75,56.19 127.13,60.81 IC12.13 | v155.22,52.45 160.38,52.45 161.98,50.85 168.91,50.85 JP5.19
CLK1L
  Bottom 0.152: IC5.11 110.59,12.8 110.59,13.34 114.86,17.6 114.86,41.25 126.95,53.34 IC12.10 127.13,53.34 128.02,52.45 136.19,52.45 139.22,49.43 162.33,49.43 163.4,48.36 168.91,48.36 JP5.21
CLK2H  (via drill 0.33)
  Top 0.152: v141.71,76.45 141.71,76.1 145.09,72.72 152.55,72.72 v155.93,76.1 | JP5.24 171.4,45.87 171.4,46.76 170.33,47.83 170.33,63.65 169.44,64.54 168.38,64.54 159.84,73.08 159.84,75.92 160.02,76.1 IC4.11
  Bottom 0.152: v141.71,76.45 134.24,68.99 134.24,63.12 134.77,62.59 136.19,62.59 137.44,61.34 137.44,57.96 136.02,56.54 136.02,56.01 IC15.4 | v155.93,76.1 160.02,76.1 IC4.11
CLK2L
  Bottom 0.152: IC3.11 143.49,76.1 136.02,68.63 136.02,63.65 IC15.1 136.02,63.48 139.57,59.92 144.02,59.92 145.09,58.85 145.09,58.67 151.31,52.45 152.73,52.45 155.4,49.78 162.51,49.78 162.69,49.61 169.09,49.61 169.98,48.72 169.98,45.7 171.4,44.27 171.4,43.2 JP5.26
CLK3H  (via drill 0.33)
  Top 0.152: v156.46,55.3 154.86,56.9 151.49,56.9 147.57,60.81 143.66,60.81 IC15.13 | v168.2,54.59 v165,54.59 | IC8.11 160.02,13.34 171.93,25.25 171.93,39.65 173,40.72 173,49.25 JP5.20
  Bottom 0.152: v156.46,55.3 158.6,55.3 159.31,54.59 v165,54.59 | v168.2,54.59 169.27,54.59 169.98,53.87 169.98,52.27 JP5.20
CLK3L
  Top 0.152: 139.22,34.67 139.22,37.16 137.44,38.94 137.44,47.3 143.49,53.34 IC15.10 | 139.22,34.67 139.22,17.6 143.49,13.34 143.49,12.8 IC7.11 | 139.22,34.67 141.88,34.67 142.24,34.31 155.57,34.31 165.53,44.27 171.58,44.27 172.64,45.34 172.64,46.05 171.58,47.12 171.58,48.18 JP5.22
DATA0  (via drill 0.33)
  Top 0.152: IC7.3 136.02,30.58 136.02,32.89 IC7.2 135.84,33.07 135.84,33.6 133.17,36.27 v133.17,53.87 | IC5.2 102.95,32.89 102.95,30.58 IC5.3 103.83,29.52 128.02,29.52 v128.91,30.4 | v57.61,21.16 56.01,21.16 54.94,20.09 54.94,18.67 53.7,17.42 45.34,17.42 43.74,19.02 43.2,19.02 IC16.3 | v89.61,33.07 87.66,31.11 87.66,30.94 86.06,29.34 78.59,29.34 76.28,27.03 76.28,26.67 IC31.18 | IC1.2 102.95,96.37 102.95,94.06 IC1.3 | v132.46,99.92 135.84,96.55 IC3.2 136.02,96.37 136.02,94.06 IC3.3 135.84,93.88 133.35,91.39 v133.35,72.19
  Bottom 0.152: v57.61,21.16 57.96,21.16 59.38,22.58 60.98,22.58 67.39,28.98 73.79,28.98 76.1,26.67 IC31.18 | v89.61,33.07 102.77,33.07 IC5.2 | v128.91,30.4 135.84,30.4 IC7.3 | 74.32,87.48 73.79,87.48 RN3.2 | 74.32,87.48 76.81,84.99 93.88,84.99 IC1.3 | JP5.3 168.91,72.19 169.98,73.25 169.98,75.74 160.38,85.34 159.13,85.34 153.97,90.5 146.33,90.5 144.37,92.46 137.44,92.46 136.02,93.88 IC3.3 | 74.32,87.48 75.21,88.37 75.21,88.54 91.21,104.55 127.84,104.55 v132.46,99.92 | v133.17,53.87 128.55,58.5 128.55,58.85 127.48,59.92 126.06,59.92 125.35,60.63 125.35,64.54 132.99,72.19 v133.35,72.19
DATA1  (via drill 0.33)
  Top 0.152: IC1.5 102.95,88.9 102.95,91.39 IC1.4 102.77,91.57 102.77,92.1 100.99,93.88 100.99,99.75 101.7,100.46 112.9,100.46 v113.26,100.1 | IC3.5 136.02,88.9 136.02,91.39 IC3.4 | IC5.5 102.95,25.43 102.95,27.91 IC5.4 102.95,28.09 108.64,28.09 109.53,28.98 130.33,28.98 v131.04,28.27 | IC7.5 136.02,25.43 136.02,27.91 IC7.4 | v141.53,83.39 141.53,78.77 142.6,77.7 146.51,77.7 v150.77,73.43 | v125.7,100.1 127.84,100.1 134.24,93.7 v134.24,93.17 | IC31.17 79.3,26.67 80.9,28.27 v85.7,28.27
  Bottom 0.152: IC16.4 45.87,19.02 46.41,19.02 48.36,17.07 58.32,17.07 59.92,18.67 59.92,19.91 62.76,22.76 74.85,22.76 78.77,26.67 IC31.17 | RN3.3 76.28,87.48 76.99,87.48 79.12,85.34 92.28,85.34 101.88,94.94 103.83,94.94 104.37,94.41 104.37,92.99 102.95,91.57 IC1.4 | JP5.5 168.91,68.1 167.49,66.67 167.49,65.96 | 167.49,65.96 167.49,63.3 168.38,62.41 169.62,62.41 170.33,61.7 170.33,60.45 171.22,59.56 171.93,59.56 174.42,57.07 174.42,39.29 161.44,26.31 136.91,26.31 136.02,25.43 IC7.5 | v131.04,28.27 135.66,28.27 135.84,28.09 IC7.4 | v141.53,83.39 136.02,88.9 IC3.5 | v150.77,73.43 156.46,67.74 156.46,67.03 157.53,65.96 167.49,65.96 | v125.7,100.1 v113.26,100.1 | v134.24,93.17 135.84,91.57 IC3.4 | v85.7,28.27 86.77,28.27 88.01,27.03 88.01,25.6 91.75,21.87 103.83,21.87 104.37,22.4 104.37,23.82 102.95,25.25 IC5.5
DATA2  (via drill 0.33)
  Top 0.152: IC7.6 136.02,22.76 136.02,20.45 IC7.7 135.84,20.27 135.84,19.74 133.88,17.78 | IC5.7 102.95,20.45 102.95,22.76 IC5.6 | 133.88,17.78 128.55,12.45 128.55,12.27 128.02,11.73 122.33,11.73 119.84,14.22 116.28,14.22 v113.44,17.07 | IC1.7 102.95,83.92 102.95,86.23 IC1.6 | IC3.7 136.02,83.92 136.02,86.23 IC3.6 136.02,86.41 138.51,88.9 v138.51,93.17 | v125.17,86.23 v121.26,86.23 | v134.06,17.6 133.88,17.78
  Bottom 0.152: 80.37,27.56 81.25,26.67 IC31.16 | 80.37,27.56 78.23,29.69 67.03,29.69 60.63,23.29 58.14,23.29 54.05,19.2 53.34,19.2 IC16.7 | 80.37,27.56 84.81,32 84.81,33.43 86.06,34.67 86.59,34.67 92.46,28.8 92.46,26.31 95.83,22.94 102.77,22.94 IC5.6 | v113.44,17.07 111.66,17.07 111.48,16.89 106.32,16.89 102.95,20.27 IC5.7 | 104.72,88.19 104.72,94.59 104.01,95.3 101.7,95.3 92.1,85.7 81.25,85.7 79.48,87.48 78.77,87.48 RN3.4 | 104.72,88.19 102.95,86.41 IC1.6 | 171.93,64.9 171.04,64.9 169.98,65.96 168.91,65.96 JP5.7 | 171.93,64.9 173.35,66.32 173.35,80.01 160.38,92.99 155.93,92.99 153.62,95.3 140.64,95.3 v138.51,93.17 | 104.72,88.19 106.68,88.19 109.53,85.34 120.37,85.34 v121.26,86.23 | v125.17,86.23 125.17,86.41 126.06,87.3 134.95,87.3 IC3.6 | v134.06,17.6 135.13,16.54 161.26,16.54 175.49,30.76 175.49,61.34 171.93,64.9
DATA3  (via drill 0.33)
  Top 0.152: 136.02,17.78 136.02,15.29 IC7.9 | IC5.8 102.95,17.78 102.95,15.29 IC5.9 102.95,15.11 103.83,14.22 v112.37,14.22 | v85.7,24.89 83.92,26.67 IC31.15 | IC1.9 102.95,78.77 102.95,81.25 IC1.8 | v82.14,84.28 81.43,84.99 81.43,87.48 RN3.5 | IC3.8 136.02,81.25 136.02,78.77 IC3.9 135.84,78.59 134.24,76.99 134.24,75.56 136.19,73.61 | v157.89,59.92 157.89,60.81 158.95,61.87 160.38,61.87 161.62,63.12 161.62,64.9 164.11,67.39 164.47,67.39 168.2,63.65 168.91,63.65 JP5.9 | v138.86,70.59 138.86,70.94 136.19,73.61 | v124.1,79.65 126.59,77.17 128.02,77.17 131.75,73.43 131.75,70.59 132.28,70.05 132.64,70.05 | 136.19,73.61 132.64,70.05 | 136.02,17.78 136.02,18.49 137.44,19.91 137.44,28.27 136.19,29.52 134.95,29.52 132.46,32 132.46,54.05 v133.17,54.76 | 132.64,70.05 v133.17,69.52 | 136.02,17.78 IC7.8
  Bottom 0.152: IC16.8 56.01,19.2 56.01,20.45 58.5,22.94 60.81,22.94 67.21,29.34 78.05,29.34 80.37,27.03 80.37,25.6 80.9,25.07 82.14,25.07 83.74,26.67 IC31.15 | IC5.8 97.26,17.78 93.88,21.16 89.43,21.16 v85.7,24.89 | v112.37,14.22 133.53,14.22 134.42,15.11 135.84,15.11 IC7.9 | v82.14,84.28 99.92,84.28 102.77,81.43 IC1.8 | v157.89,59.92 152.91,64.9 144.73,64.9 139.04,70.59 v138.86,70.59 | v124.1,79.65 106.5,79.65 105.61,78.77 102.95,78.77 IC1.9 | v133.17,69.52 v133.17,54.76
DATA4  (via drill 0.33)
  Top 0.152: IC7.12 143.49,15.29 143.49,17.78 IC7.13 | IC5.12 110.59,15.29 110.59,17.78 IC5.13 | v67.56,28.27 v64.72,28.27 | v75.56,24.89 84.81,24.89 85.52,24.18 85.88,24.18 86.41,24.71 86.41,26.67 IC31.14 | IC1.12 110.59,78.77 110.59,81.25 IC1.13 110.59,81.43 112.01,82.86 112.01,96.9 111.48,97.43 110.24,97.43 109.17,98.5 v108.28,98.5 | IC3.13 143.49,81.25 143.49,78.77 IC3.12 144.2,78.05 v147.04,78.05 | v100.64,67.92 100.64,72.01 105.97,77.34 v105.97,78.23
  Bottom 0.152: IC16.13 56.54,26.67 58.14,28.27 v64.72,28.27 | v67.56,28.27 70.94,24.89 v75.56,24.89 | IC31.14 86.41,26.67 91.57,21.51 103.66,21.51 107.39,17.78 IC5.13 110.59,17.78 110.59,18.49 112.01,19.91 112.01,30.94 110.95,32 109.53,32 100.64,40.89 v100.64,67.92 | IC7.12 143.49,15.11 137.79,15.11 136.37,13.69 113.44,13.69 111.48,11.73 109.53,11.73 108.99,12.27 108.99,13.69 110.41,15.11 IC5.12 | v108.28,98.5 107.92,98.15 101.52,98.15 93.34,89.97 86.77,89.97 84.45,87.66 83.92,87.66 RN3.6 | v147.04,78.05 147.04,71.48 150.6,67.92 151.84,67.92 157.18,62.59 160.38,62.59 161.98,60.98 168.91,60.98 JP5.11 | IC3.12 143.49,78.59 142.6,77.7 118.42,77.7 117.53,78.59 110.59,78.59 IC1.12 110.41,78.59 110.06,78.23 v105.97,78.23
DATA5  (via drill 0.33)
  Top 0.152: IC7.15 143.49,22.76 143.49,20.45 IC7.14 143.66,20.27 143.66,19.56 145.09,18.14 145.09,12.27 | v77.52,27.38 79.12,28.98 v86.59,28.98 | IC31.13 91.57,24 103.66,24 104.72,22.94 110.41,22.94 IC5.15 110.59,22.76 110.59,20.45 IC5.14 110.59,20.27 112.01,18.85 112.01,17.6 118.24,11.38 144.2,11.38 145.09,12.27 | IC1.14 110.59,83.92 110.59,86.23 IC1.15 | 143.49,84.1 143.49,86.23 IC3.15 | 143.49,84.1 143.49,83.92 IC3.14 143.49,84.1 | v149.53,73.43 148.28,73.43 144.37,77.34 142.42,77.34 140.82,78.94 140.82,83.57 141.35,84.1 143.49,84.1 | v126.42,90.14 v124.64,90.14 | 145.09,12.27 150.95,12.27 151.49,11.73 161.09,11.73 172.29,22.94 172.29,39.47 173.35,40.54 v173.35,55.47
  Bottom 0.152: IC16.14 53.34,20.98 52.45,20.09 52.45,17.96 52.98,17.42 56.19,17.42 57.43,18.67 57.43,20.09 59.56,22.23 61.7,22.23 62.59,23.11 74.68,23.11 77.52,25.96 v77.52,27.38 | IC31.13 v86.59,28.98 | 108.99,90.14 108.99,87.83 110.41,86.41 IC1.15 | 108.99,90.14 108.99,92.28 103.83,97.43 101.88,97.43 101.35,96.9 101.35,95.66 91.75,86.06 88.54,86.06 87.12,87.48 86.41,87.48 RN3.7 | v149.53,73.43 150.24,72.72 150.95,72.72 155.93,67.74 155.93,67.03 157.35,65.61 159.84,65.61 163.4,62.05 169.44,62.05 169.98,61.52 169.98,60.45 168.91,59.38 JP5.13 168.91,58.32 169.98,57.25 171.58,57.25 v173.35,55.47 | v124.64,90.14 108.99,90.14 | v126.42,90.14 127.84,90.14 128.19,89.79 140.11,89.79 143.49,86.41 IC3.15
DATA6  (via drill 0.33)
  Top 0.152: IC3.16 143.49,88.9 143.49,91.39 IC3.17 143.66,91.57 143.66,92.1 145.09,93.52 145.09,100.1 141,104.19 121.97,104.19 120.9,103.12 120.9,100.64 122.68,98.86 v122.68,94.41 | RN3.8 88.9,87.66 89.43,87.66 91.03,89.26 91.75,89.26 94.06,86.94 94.06,81.97 94.59,81.43 96.01,81.43 102.59,88.01 104.01,88.01 104.37,88.37 104.37,96.9 103.12,98.15 101.88,98.15 101.35,98.68 101.35,99.57 101.88,100.1 103.83,100.1 108.99,94.94 108.99,92.99 110.41,91.57 IC1.17 110.59,91.39 110.59,88.9 IC1.16 110.41,88.9 110.41,88.19 107.04,84.81 107.04,60.63 103.83,57.43 90.68,57.43 v88.01,60.1 | IC7.16 143.49,25.43 143.49,27.91 IC7.17 | JP5.15 168.91,54.94 169.98,53.87 169.98,50.32 169.09,49.43 168.55,49.43 158.42,39.29 158.42,38.05 v155.4,35.03 | IC16.17 46.23,26.67 47.83,28.27 54.41,28.27 v57.61,31.47 | v88.01,32.36 v88.01,37.16 | IC31.12 91.57,26.67 93.88,24.36 103.83,24.36 104.72,25.25 110.41,25.25 IC5.16 110.59,25.43 110.59,27.91 IC5.17 110.59,28.09 110.77,28.27 v115.57,28.27
  Bottom 0.152: v122.68,94.41 121.79,94.41 119.84,92.46 111.48,92.46 110.59,91.57 IC1.17 | v155.4,35.03 155.4,34.14 152.73,31.47 147.04,31.47 IC7.17 143.49,28.09 141.88,28.09 140.64,29.34 116.64,29.34 v115.57,28.27 | v57.61,31.47 60.1,31.47 60.45,31.11 79.3,31.11 80.37,32.18 80.37,34.14 83.39,37.16 v88.01,37.16 v88.01,60.1 | v88.01,32.36 88.01,30.05 91.39,26.67 IC31.12
DATA7  (via drill 0.33)
  Top 0.152: IC3.18 143.49,94.06 143.49,96.37 IC3.19 | IC1.18 110.59,94.06 110.59,96.37 IC1.19 | IC7.18 143.49,30.58 143.49,32.89 IC7.19 | JP5.17 161.8,46.23 v157.18,46.23 | IC5.18 110.59,30.58 110.59,32.89 IC5.19 110.59,33.07 112.19,34.67 v115.57,34.67 | IC16.18 43.74,26.67 48.18,31.11 v51.74,31.11 | v88.72,66.85 89.08,66.85 100.28,78.05 100.28,78.41 99.75,78.94 99.39,78.94 97.61,77.17 88.54,77.17 88.01,77.7 88.01,79.83 91.39,83.21 91.39,87.48 RN3.9
  Bottom 0.152: RN3.9 91.57,87.66 101.7,97.79 109.17,97.79 110.41,96.55 IC1.19 | IC3.19 143.49,96.37 137.62,96.37 136.55,95.3 122.68,95.3 122.15,94.77 120.55,94.77 120.37,94.94 111.48,94.94 110.59,94.06 IC1.18 | v157.18,46.23 156.82,46.23 143.66,33.07 IC7.19 143.49,33.07 141.88,34.67 v115.57,34.67 | v51.74,31.11 57.07,31.11 57.43,30.76 80.9,30.76 82.86,32.72 82.86,33.96 83.92,35.03 86.77,35.03 | 93.88,27.91 86.77,35.03 | 93.88,27.91 93.88,26.67 IC31.11 | 93.88,27.91 94.94,28.98 103.3,28.98 104.72,30.4 110.41,30.4 IC5.18 | v88.72,66.85 88.72,36.98 86.77,35.03
DATA8  (via drill 0.33)
  Top 0.152: IC30.18 43.2,40.72 43.2,46.94 IC17.3 43.2,47.12 43.92,47.12 45.34,48.54 46.05,48.54 47.3,47.3 47.3,46.05 48.01,45.34 51.03,45.34 52.45,46.76 52.45,48.18 56.9,52.63 56.9,59.03 v56.36,59.56 | 65.43,80.37 72.01,80.37 73.61,78.77 RN4.2 | 65.43,80.37 v58.85,80.37 | v54.59,70.59 52.63,72.54 50.32,72.54 v49.25,73.61 | IC6.3 119.48,30.58 119.48,32.89 IC6.2 | IC8.3 152.38,30.58 152.38,32.89 IC8.2 | IC2.3 119.48,94.06 119.48,96.37 IC2.2 | IC4.3 152.38,94.06 152.38,96.37 IC4.2 | v161.62,46.94 161.62,54.94 161.98,55.3 161.98,64.36 v164.29,66.67 | 65.43,80.37 65.43,86.06 68.63,89.26 79.83,89.26 v80.19,88.9
  Bottom 0.152: 49.25,77.88 56.36,77.88 v58.85,80.37 | 49.25,77.88 45.52,77.88 44.27,76.63 44.27,72.9 43.2,71.83 43.2,69.88 IC29.18 | v56.36,59.56 54.59,61.34 v54.59,70.59 | 49.25,77.88 v49.25,73.61 | IC6.2 119.48,32.89 125.17,32.89 126.24,31.83 142.24,31.83 142.42,31.65 146.69,31.65 147.93,32.89 152.38,32.89 IC8.2 152.55,33.07 152.55,33.78 153.97,35.2 153.97,40.36 160.55,46.94 v161.62,46.94 | 171.4,71.12 171.4,72.19 170.33,73.25 170.33,78.05 160.38,88.01 158.42,88.01 152.55,93.88 IC4.3 | IC4.2 151.49,97.43 125.88,97.43 124.99,96.55 119.48,96.55 IC2.2 119.3,96.55 115.93,96.55 112.55,99.92 112.55,100.28 113.08,100.81 123.75,100.81 125.35,102.41 125.35,103.3 124.46,104.19 95.83,104.19 80.54,88.9 v80.19,88.9 | v164.29,66.67 165.53,66.67 168.91,70.05 170.33,70.05 171.4,71.12 | 171.4,71.12 JP5.4
DATA9  (via drill 0.33)
  Top 0.152: IC30.17 45.7,40.72 45.7,46.94 IC17.4 | v59.03,77.52 70.41,77.52 70.76,77.17 74.68,77.17 76.1,78.59 RN4.3 | v49.96,49.61 49.96,50.32 52.45,52.81 52.45,56.01 v50.32,58.14 | IC6.5 119.48,25.43 119.48,27.91 IC6.4 | IC8.4 152.38,27.91 152.38,25.43 IC8.5 152.38,25.25 152.38,24.71 150.77,23.11 150.77,14.94 v151.66,14.05 | IC2.4 119.48,91.39 119.48,88.9 IC2.5 119.3,88.9 117.88,87.48 117.88,83.39 118.42,82.86 119.84,82.86 120.9,81.79 120.9,74.85 113.61,67.56 v113.61,67.21 | IC4.5 152.38,88.9 152.38,91.39 IC4.4 | JP5.6 v174.07,65.96 | v101.35,69.88 105.61,69.88 v105.97,70.23
  Bottom 0.152: v59.03,77.52 57.43,75.92 57.43,74.5 56.36,73.43 49.96,73.43 46.41,69.88 45.87,69.88 IC29.17 45.7,69.7 44.45,68.45 44.45,61.52 45.34,60.63 46.58,60.63 49.07,58.14 v50.32,58.14 | v49.96,49.61 49.61,49.25 48.54,49.25 46.41,47.12 45.87,47.12 IC17.4 | IC8.4 151.49,27.03 142.42,27.03 140.46,28.98 126.06,28.98 125.17,28.09 119.48,28.09 IC6.4 | JP5.6 171.58,68.63 171.58,69.7 172.64,70.76 172.64,78.23 160.38,90.5 157.89,90.5 153.44,94.94 151.49,94.94 150.77,94.23 150.77,93.17 152.38,91.57 IC4.4 | IC4.5 147.4,88.9 145.8,90.5 134.95,90.5 130.5,94.94 126.06,94.94 122.68,91.57 119.48,91.57 IC2.4 | v151.66,14.05 160.73,14.05 176.38,29.69 176.38,63.65 v174.07,65.96 | v101.35,69.88 98.32,69.88 90.5,77.7 90.5,79.12 89.26,80.37 80.9,80.37 80.37,79.83 80.37,78.41 79.12,77.17 78.41,77.17 76.99,78.59 76.28,78.59 RN4.3 | v105.97,70.23 110.59,70.23 v113.61,67.21
DATA10  (via drill 0.33)
  Top 0.152: IC30.16 48.36,40.72 48.36,41.96 53.34,46.94 IC17.7 | v59.74,75.74 60.45,76.45 66.85,76.45 67.21,76.1 76.1,76.1 RN4.4 | v51.56,48.9 49.25,48.9 48.36,49.78 48.36,50.14 51.74,53.52 51.74,55.65 50.32,57.07 49.96,57.07 49.25,57.78 v49.25,59.21 | IC6.7 119.48,20.45 119.48,22.76 IC6.6 | IC8.7 152.38,20.45 152.38,22.76 IC8.6 | 119.48,85.17 119.48,86.23 IC2.6 119.48,86.41 121.26,88.19 121.26,99.75 119.48,101.52 v87.3,101.52 | 119.48,85.17 119.48,83.92 IC2.7 | IC4.7 152.38,83.92 152.38,86.23 IC4.6 | v154.69,82.5 154.69,82.14 159.13,77.7 160.55,77.7 161.62,76.63 161.62,74.32 168.55,67.39 169.09,67.39 170.33,66.14 171.4,66.14 JP5.8 | 125.35,85.17 119.48,85.17 | v132.46,26.49 132.46,30.23 132.1,30.58 132.1,55.12 v132.46,55.47 | v132.46,70.76 132.46,77.7 127.31,82.86 126.06,82.86 125.35,83.57 125.35,85.17 | 125.35,85.17 v125.53,85.17
  Bottom 0.152: v59.74,75.74 59.74,74.32 58.5,73.08 52.09,73.08 48.9,69.88 48.36,69.88 IC29.16 48.18,69.7 46.58,68.1 46.58,63.48 46.76,63.3 46.76,61.7 v49.25,59.21 | v51.56,48.9 53.34,47.12 IC17.7 | 132.46,21.34 151.49,21.34 152.38,20.45 IC8.7 | 132.46,21.34 126.06,21.34 125.17,20.45 119.48,20.45 IC6.7 | v154.69,82.5 153.8,82.5 152.55,83.74 IC4.7 152.38,83.74 151.31,82.68 141.35,82.68 138.86,85.17 v125.53,85.17 | v132.46,26.49 132.46,21.34 | v132.46,70.76 v132.46,55.47 | v87.3,101.52 85.52,101.52 72.72,88.72 72.72,86.59 78.59,80.72 78.59,78.77 RN4.4
DATA11  (via drill 0.33)
  Top 0.152: IC30.15 50.85,40.54 51.56,40.54 52.98,39.12 53.7,39.12 54.94,40.36 54.94,46.05 IC17.8 56.01,47.12 56.01,50.32 59.38,53.7 59.38,57.43 v57.25,59.56 | 57.25,66.85 64.36,66.85 70.94,73.43 v80.19,73.43 80.19,71.65 82.86,68.99 82.86,67.56 83.39,67.03 88.01,67.03 96.9,75.92 v97.26,75.92 | 57.25,66.85 54.41,66.85 51.56,69.7 50.85,69.7 IC29.15 | 57.25,66.85 v57.25,66.5 | IC6.9 119.48,15.29 119.48,17.78 IC6.8 | IC8.9 152.38,15.29 152.38,17.78 IC8.8 | IC2.8 119.48,81.25 119.48,78.77 IC2.9 119.3,78.59 117.88,77.17 117.88,72.36 112.19,66.67 v112.19,66.32 | IC4.9 152.38,78.77 152.38,81.25 IC4.8 | v160.55,73.25 160.55,72.9 168.55,64.9 169.62,64.9 170.87,63.65 171.4,63.65 JP5.10
  Bottom 0.152: v80.19,73.43 80.19,77.52 81.25,78.59 RN4.5 | v57.25,66.5 v57.25,59.56 | IC6.8 124.99,17.78 125.88,18.67 151.49,18.67 152.38,17.78 IC8.8 158.06,17.78 158.95,16.89 161.09,16.89 175.13,30.94 175.13,60.63 172.29,63.48 171.58,63.48 JP5.10 | v160.55,73.25 157.89,73.25 IC4.9 | IC2.8 119.48,81.43 122.68,81.43 126.06,84.81 138.68,84.81 141.17,82.32 151.49,82.32 152.38,81.43 IC4.8 | v97.26,75.92 98.15,75.92 107.04,67.03 107.04,66.85 107.57,66.32 v112.19,66.32
DATA12  (via drill 0.33)
  Top 0.152: IC6.12 127.13,15.29 127.13,17.78 IC6.13 | IC8.13 IC8.12 | IC4.13 160.02,78.77 | 160.02,78.77 161.98,76.81 161.98,76.45 168.38,70.05 168.91,70.05 169.98,68.99 169.98,68.45 171.04,67.39 171.58,67.39 172.64,66.32 172.64,63.12 171.58,62.05 171.58,60.98 JP5.12 171.58,60.81 v174.07,60.81 | 160.02,78.77 IC4.12 | IC30.14 53.34,44.09 v54.23,44.98 | v52.81,49.43 52.98,49.43 55.83,52.27 55.83,54.59 IC17.13 55.83,54.76 54.23,56.36 v54.23,58.14 | v84.28,81.43 83.92,81.08 83.92,78.77 RN4.6 83.74,78.59 79.83,74.68 66.85,74.68 66.67,74.85 v66.14,74.85 | IC29.14 53.34,68.63 54.76,67.21 60.27,67.21 v66.14,73.08
  Bottom 0.152: IC6.12 127.13,15.29 134.06,15.29 134.95,16.18 159.13,16.18 160.02,15.29 IC8.12 | v54.23,44.98 54.23,48.01 v52.81,49.43 | IC29.14 53.34,64.19 54.23,63.3 v54.23,58.14 | v84.28,81.43 93.17,81.43 94.59,82.86 99.39,82.86 101.88,80.37 126.06,80.37 | 126.06,80.37 126.95,81.25 IC2.13 | 126.06,80.37 126.77,79.65 | 126.77,79.65 126.95,79.48 126.95,78.77 IC2.12 | v66.14,74.85 v66.14,73.08 | 126.77,79.65 153.44,79.65 154.33,78.77 160.02,78.77 IC4.12 | IC8.13 160.02,18.31 174.78,33.07 174.78,60.1 v174.07,60.81
DATA13  (via drill 0.33)
  Top 0.152: v55.83,45.16 55.83,40.72 IC30.13 | v52.98,50.32 52.98,54.23 53.34,54.59 IC17.14 | IC6.14 127.13,20.45 127.13,22.76 IC6.15 | IC8.15 IC8.14 | IC2.14 127.13,83.92 127.13,86.23 IC2.15 121.97,91.39 v121.97,95.48 | IC4.15 IC4.14 160.02,83.74 162.87,83.74 174.78,71.83 174.78,60.63 173.71,59.56 | 173.71,59.56 172.64,58.5 171.58,58.5 JP5.14 | v173,35.92 173,39.65 174.6,41.25 174.6,58.67 173.71,59.56 | v89.97,90.68 88.01,88.72 88.01,87.3 86.41,85.7 86.41,78.77 RN4.7
  Bottom 0.152: IC17.14 53.34,54.76 54.05,54.76 56.01,56.72 57.96,56.72 62.23,60.98 62.23,63.48 56.01,69.7 IC29.13 | v55.83,45.16 54.59,46.41 54.59,48.72 v52.98,50.32 | RN4.7 86.23,78.59 86.23,70.41 85.34,69.52 85.34,64.01 85.52,63.83 85.52,62.05 84.81,61.34 84.81,39.12 79.65,33.96 79.65,32 79.12,31.47 78.41,31.47 77.17,32.72 77.17,37.69 75.21,39.65 75.21,41.6 73.97,42.85 58.14,42.85 56.01,40.72 IC30.13 | IC6.14 127.13,20.27 134.06,20.27 134.95,19.38 159.13,19.38 160.02,20.27 IC8.14 | IC2.14 127.13,83.74 131.39,83.74 134.77,80.37 156.64,80.37 160.02,83.74 IC4.14 | v173,35.92 160.02,22.94 IC8.15 | v89.97,90.68 92.46,90.68 101.88,100.1 107.57,100.1 110.24,97.43 114.5,97.43 116.46,95.48 v121.97,95.48
DATA14  (via drill 0.33)
  Top 0.152: IC6.16 127.13,25.43 127.13,27.91 IC6.17 | IC8.17 IC8.16 | v58.32,51.56 57.43,50.67 57.43,46.05 58.32,45.16 58.32,40.72 IC30.12 | v49.25,60.1 45.87,56.72 45.87,54.76 IC17.17 | IC4.17 IC4.16 v154.69,88.9 | v105.97,82.32 105.44,82.32 | 105.44,82.32 101.88,82.32 100.64,81.08 91.75,81.08 89.43,78.77 88.9,78.77 RN4.8 | IC2.17 127.13,91.39 127.13,88.9 IC2.16 | v73.43,65.43 90.14,65.43 102.06,77.34 104.01,77.34 105.44,78.77 105.44,82.32 | JP5.16 173.89,58.32 v173.89,58.5
  Bottom 0.152: 158.42,29.69 158.42,30.76 159.13,31.47 161.26,31.47 169.98,40.18 169.98,40.72 171.04,41.78 172.11,41.78 173,42.67 173,50.85 171.93,51.92 171.4,51.92 170.33,52.98 170.33,53.7 171.4,54.76 171.4,55.83 JP5.16 | 158.42,29.69 160.02,28.09 IC8.17 | 158.42,29.69 155.4,26.67 135.13,26.67 134.24,27.56 130.86,27.56 130.5,27.91 127.13,27.91 IC6.17 | IC17.17 45.87,54.59 47.83,52.63 56.9,52.63 57.96,51.56 v58.32,51.56 62.05,51.56 69.16,58.67 69.16,61.16 v73.43,65.43 | v49.25,60.1 49.25,62.59 52.45,65.79 52.45,70.94 52.98,71.48 56.19,71.48 57.78,69.88 58.32,69.88 IC29.12 | v105.97,82.32 120.37,82.32 126.95,88.9 IC2.16 | v154.69,88.9 154.33,88.9 153.44,88.01 142.42,88.01 140.28,90.14 128.37,90.14 127.13,91.39 IC2.17 | v173.89,58.5 173.89,60.1 171.58,62.41 171.04,62.41 169.98,63.48 169.98,64.01 169.09,64.9 168.55,64.9 167.84,65.61 167.84,66.5 168.73,67.39 171.75,67.39 173,68.63 173,78.41 160.02,91.39 IC4.17
DATA15  (via drill 0.33)
  Top 0.152: IC6.18 127.13,30.58 127.13,32.89 IC6.19 | IC8.18 IC8.19 160.02,33.07 159.13,33.96 v141.71,33.96 | v47.3,63.65 47.3,58.85 43.2,54.76 IC17.18 | v62.94,48.54 v62.94,42.14 | IC4.19 IC4.18 160.02,93.88 175.67,78.23 175.67,41.78 173.71,39.83 v173.71,39.47 | 101.17,78.41 101.88,77.7 103.83,77.7 104.72,78.59 v104.72,81.61 | 101.17,78.41 100.28,79.3 99.21,79.3 98.68,78.77 91.57,78.77 RN4.9 | IC2.18 127.13,94.06 127.13,96.37 IC2.19 127.13,96.55 v128.73,98.15 | v70.23,67.21 70.59,67.21 71.65,66.14 88.9,66.14 101.17,78.41
  Bottom 0.152: 172.64,40.36 162.87,30.58 160.02,30.58 IC8.18 | 172.64,40.36 173.35,41.07 173.35,51.03 171.58,52.81 171.58,53.34 JP5.18 | v141.71,33.96 134.95,33.96 134.06,33.07 127.13,33.07 IC6.19 | v47.3,63.65 47.3,64.01 52.09,68.81 52.09,71.12 52.81,71.83 58.85,71.83 60.81,69.88 IC29.11 60.98,69.7 62.23,69.7 66.85,65.08 68.1,65.08 v70.23,67.21 | v62.94,42.14 61.52,40.72 60.98,40.72 IC30.11 | v62.94,48.54 59.92,48.54 56.54,51.92 45.87,51.92 IC17.18 | v104.72,81.61 104.72,81.97 107.75,84.99 120.9,84.99 125.35,89.43 125.35,92.28 126.95,93.88 IC2.18 | v128.73,98.15 152.73,98.15 154.33,96.55 160.02,96.55 IC4.19 | 172.64,40.36 173.53,39.47 v173.71,39.47
GND  (via drill 0.33)
  Top 0.152: C26.2 140.82,67.39 140.82,69.52 136.02,74.32 136.02,76.1 IC3.10 136.02,76.28 136.02,76.99 139.22,80.19 139.22,95.12 136.19,98.15 134.77,98.15 134.24,98.68 134.24,103.83 | 134.24,103.83 125.35,103.83 124.46,102.95 C30.2 | 134.24,103.83 138.86,103.83 139.75,102.95 140.82,102.95 C32.2 | JP5.1 168.91,73.61 171.4,73.61 JP5.2 | C38.2 124.46,43.2 119.48,48.18 IC12.7 | 106.15,54.59 103.3,51.74 101.88,51.74 101.35,51.21 101.35,49.78 IC10.7 | 106.15,54.59 107.92,56.36 107.92,67.21 C22.2 | C33.2 157.35,67.21 157.35,61.34 156.82,60.81 156.82,58.14 157.53,57.43 157.53,53.34 152.55,48.36 IC14.7 | C21.2 154.86,102.77 154.15,102.77 150.77,99.39 150.77,77.88 152.38,76.28 IC4.10 | IC41.1 38.05,75.03 36.63,75.03 34.31,77.34 C27.2 | X1.A32 5.16,96.55 7.47,96.55 X1.B32 7.64,96.55 10.13,96.55 X1.C32 | v14.58,92.1 33.6,92.1 34.14,92.63 C4.2 34.31,92.63 35.56,92.63 36.8,91.39 38.76,91.39 41.6,88.54 41.6,86.59 40.72,85.7 40.72,82.68 IC41.19 | C28.2 38.05,106.68 40.54,109.17 IC9.15 | IC29.10 63.48,62.23 67.21,65.96 C1.2 | v56.01,97.08 56.9,96.19 56.9,92.1 | 56.9,92.1 56.9,88.54 56.01,87.66 IC11.8 | 56.9,92.1 43.74,92.1 40.72,95.12 IC11.15 | X1.A1 X1.B1 X1.C1 | v34.31,26.85 34.31,35.56 C35.2 | IC19.13 73.79,40.72 76.1,40.72 IC19.12 76.28,40.72 76.81,40.72 78.23,42.14 79.83,42.14 81.25,40.72 IC19.10 | IC19.7 86.23,33.07 86.23,38.23 IC19.9 83.92,40.72 86.23,43.03 86.23,46.94 IC20.7 | IC17.10 60.98,46.94 60.98,42.49 61.87,41.6 61.87,33.96 60.98,33.07 IC30.10 | JP5.28 171.4,40.72 168.91,40.72 JP5.27 168.91,32.36 160.38,23.82 158.95,23.82 153.97,18.85 153.97,14.22 152.55,12.8 IC8.10
  Top 0.152: IC5.10 102.77,12.8 100.28,12.8 94.06,19.02 IC31.10 | v59.21,59.56 59.74,59.56 67.21,52.09 C2.2 | 106.15,54.59 103.66,57.07 90.14,57.07 86.41,60.81 IC13.7
  Bottom 0.152: 124.46,67.39 119.48,72.36 119.48,76.1 IC2.10 | 124.46,67.39 127.13,67.39 135.84,76.1 IC3.10 | 124.46,67.39 C36.2 | C32.2 141,102.95 154.86,102.95 C21.2 | C29.2 108.1,102.95 114.15,102.95 115.04,103.83 123.57,103.83 124.46,102.95 C30.2 | IC4.10 152.55,76.1 152.55,72.19 157.35,67.39 C33.2 157.53,67.39 163.75,73.61 168.91,73.61 JP5.1 | 140.82,43.38 140.82,39.47 C24.2 | 140.82,43.38 136.02,48.18 IC15.7 135.84,48.18 133.17,48.18 124.46,39.47 C38.2 | 140.82,43.38 145.62,48.18 152.38,48.18 IC14.7 | IC1.10 102.95,76.1 102.95,72.36 107.92,67.39 C22.2 | 107.92,43.2 107.92,39.47 C39.2 | IC10.7 107.92,43.2 | 107.92,43.2 114.33,43.2 IC12.7 | IC41.19 40.54,82.5 40.01,82.5 35.03,77.52 34.31,77.52 C27.2 | C4.2 34.31,92.81 34.31,93.34 37.87,96.9 38.94,96.9 40.54,95.3 IC11.15 | v14.58,92.1 X1.C32 | C28.2 34.31,106.68 34.49,106.5 50.32,106.5 55.12,101.7 55.83,101.7 IC9.8 56.01,101.52 v56.01,97.08 | 58.67,60.1 60.81,62.23 IC29.10 | 58.67,60.1 56.01,57.43 49.25,57.43 47.65,59.03 39.29,59.03 34.31,64.01 34.31,64.72 C34.2 | C1.2 60.98,72.36 60.98,74.85 IC41.10 60.98,75.03 62.23,76.28 62.23,83.21 57.96,87.48 56.01,87.48 IC11.8 | X1.C1 10.31,17.78 16.54,24 34.14,24 C40.2 34.31,24.18 v34.31,26.85 | 54.94,16.71 58.5,16.71 60.81,19.02 IC16.10 60.98,19.2 63.3,21.51 67.21,21.51 C23.2 67.39,21.69 81.61,21.69 84.99,25.07 | 54.94,16.71 43.92,16.71 42.14,14.94 42.14,13.51 40.18,11.56 34.31,11.56 C31.2 | 54.94,16.71 54.94,12.98 55.83,12.09 55.83,6.4 IC18.8 55.83,6.22 51.56,1.96 12.98,1.96 11.56,3.38 11.56,3.91 10.49,4.98 9.96,4.98 9.07,5.87 9.07,6.4 7.64,7.82 7.64,17.78 X1.B1 | C2.2 67.21,51.92 62.41,47.12 60.98,47.12 IC17.10 60.81,47.12 56.54,51.38 35.56,51.38 35.03,51.92 34.31,51.92 C37.2